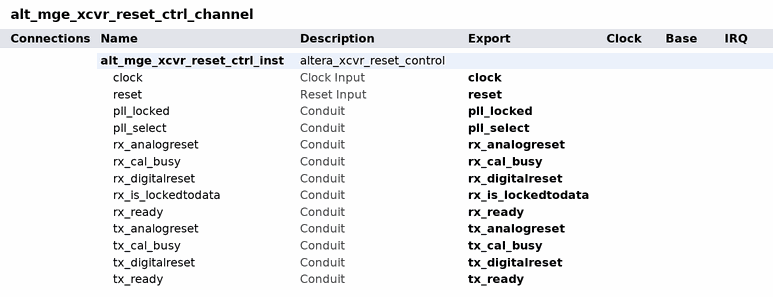
[diagram p0: system contents]
# Platform Designer (Qsys) system alt_mge_xcvr_reset_ctrl_channel, Arria V Unknown
# Parameters at their usual value, and those the tool derives, are not listed.
package require -exact qsys 14.1
create_system alt_mge_xcvr_reset_ctrl_channel
set_project_property DEVICE_FAMILY {Arria V}
set_project_property DEVICE Unknown

add_instance alt_mge_xcvr_reset_ctrl_inst altera_xcvr_reset_control 14.1
set_instance_property alt_mge_xcvr_reset_ctrl_inst AUTO_EXPORT true
set_instance_parameter_value alt_mge_xcvr_reset_ctrl_inst CHANNELS 1
set_instance_parameter_value alt_mge_xcvr_reset_ctrl_inst PLLS 2
set_instance_parameter_value alt_mge_xcvr_reset_ctrl_inst RX_PER_CHANNEL 0
set_instance_parameter_value alt_mge_xcvr_reset_ctrl_inst SYS_CLK_IN_MHZ 125
set_instance_parameter_value alt_mge_xcvr_reset_ctrl_inst TX_PLL_ENABLE 0
set_instance_parameter_value alt_mge_xcvr_reset_ctrl_inst T_RX_ANALOGRESET 40
set_instance_parameter_value alt_mge_xcvr_reset_ctrl_inst T_TX_DIGITALRESET 20
set_instance_parameter_value alt_mge_xcvr_reset_ctrl_inst device_family {Arria V}
set_instance_parameter_value alt_mge_xcvr_reset_ctrl_inst gui_pll_cal_busy 0

# exported interfaces
add_interface clock clock sink
set_interface_property clock EXPORT_OF alt_mge_xcvr_reset_ctrl_inst.clock
add_interface pll_locked conduit end
set_interface_property pll_locked EXPORT_OF alt_mge_xcvr_reset_ctrl_inst.pll_locked
add_interface pll_select conduit end
set_interface_property pll_select EXPORT_OF alt_mge_xcvr_reset_ctrl_inst.pll_select
add_interface reset reset sink
set_interface_property reset EXPORT_OF alt_mge_xcvr_reset_ctrl_inst.reset
add_interface rx_analogreset conduit end
set_interface_property rx_analogreset EXPORT_OF alt_mge_xcvr_reset_ctrl_inst.rx_analogreset
add_interface rx_cal_busy conduit end
set_interface_property rx_cal_busy EXPORT_OF alt_mge_xcvr_reset_ctrl_inst.rx_cal_busy
add_interface rx_digitalreset conduit end
set_interface_property rx_digitalreset EXPORT_OF alt_mge_xcvr_reset_ctrl_inst.rx_digitalreset
add_interface rx_is_lockedtodata conduit end
set_interface_property rx_is_lockedtodata EXPORT_OF alt_mge_xcvr_reset_ctrl_inst.rx_is_lockedtodata
add_interface rx_ready conduit end
set_interface_property rx_ready EXPORT_OF alt_mge_xcvr_reset_ctrl_inst.rx_ready
add_interface tx_analogreset conduit end
set_interface_property tx_analogreset EXPORT_OF alt_mge_xcvr_reset_ctrl_inst.tx_analogreset
add_interface tx_cal_busy conduit end
set_interface_property tx_cal_busy EXPORT_OF alt_mge_xcvr_reset_ctrl_inst.tx_cal_busy
add_interface tx_digitalreset conduit end
set_interface_property tx_digitalreset EXPORT_OF alt_mge_xcvr_reset_ctrl_inst.tx_digitalreset
add_interface tx_ready conduit end
set_interface_property tx_ready EXPORT_OF alt_mge_xcvr_reset_ctrl_inst.tx_ready

set_interconnect_requirement {$system} qsys_mm.clockCrossingAdapter HANDSHAKE
set_interconnect_requirement {$system} qsys_mm.insertDefaultSlave FALSE
set_interconnect_requirement {$system} qsys_mm.maxAdditionalLatency 1

save_system alt_mge_xcvr_reset_ctrl_channel.qsys
